# EAGLE schematic Esquematicodrivers (EAGLE 9.6.2)
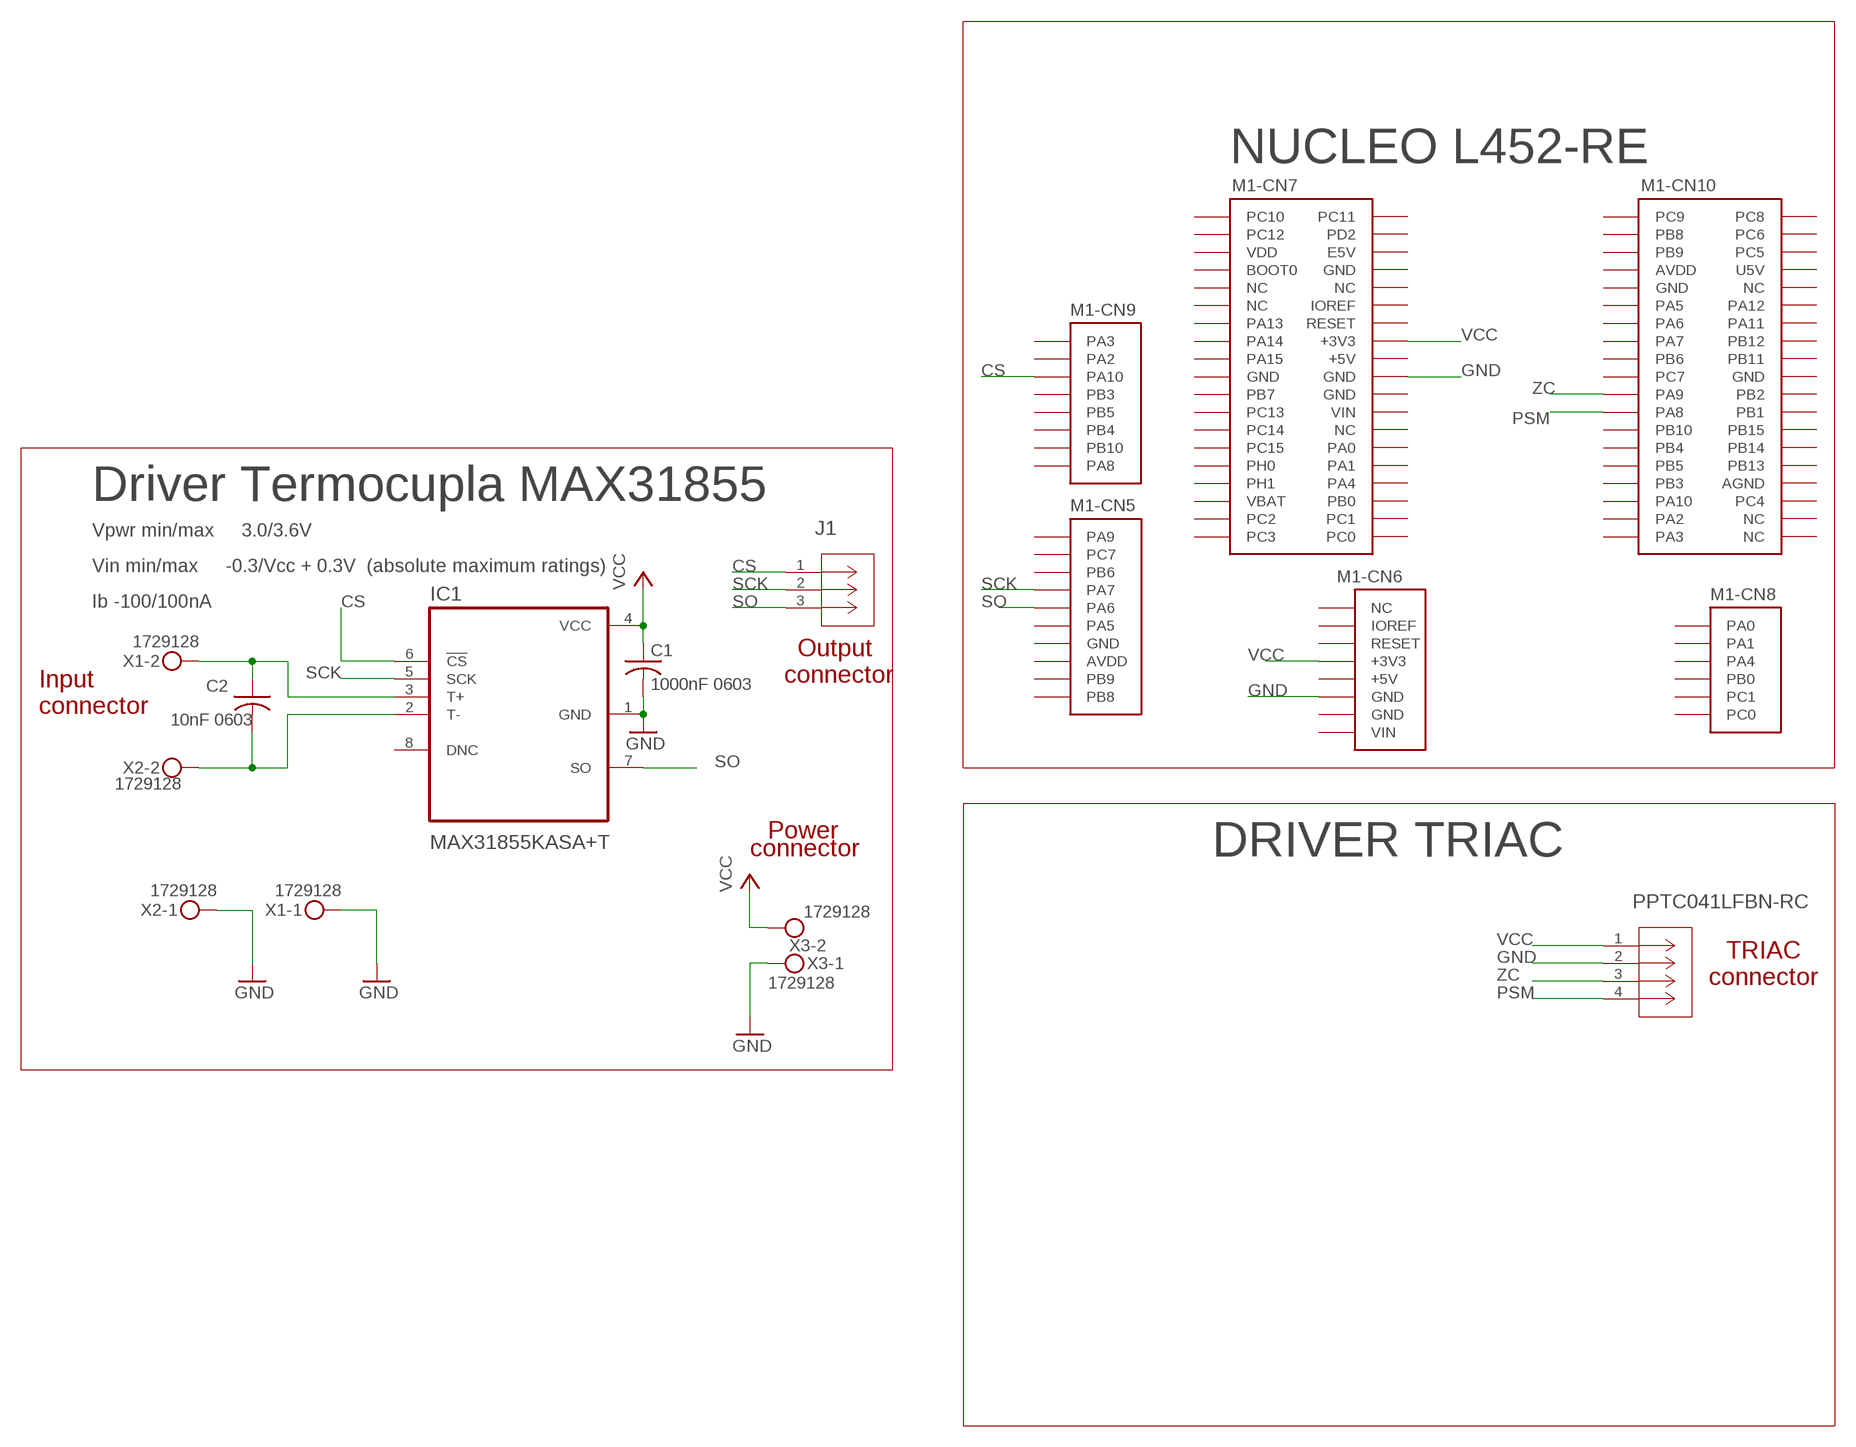
[diagram p0: schematic, sheet 1]

## Parts
C1  1000nF 0603  C-USC0603  [C0603]
C2  10nF 0603  C-USC0603  [C0603]
IC1  MAX31855KASA+T  [SOIC127P600X175-8N]
J1  PPPC031LFBN-RCCONN_PPPC031LFBN-RC_SUL  [CONN_PPPC031LFBN-RC_SUL]
M1  NUCLEO-L452RE  [NUCLEO-64]
PPTC041LFBN-RC  PPTC041LFBN-RCCONN_PPTC041LFBN-RC_SUL  [CONN_PPTC041LFBN-RC_SUL]
X1  1729128  MKDSN1,5/2-5,08  [MKDSN1,5/2-5,08]
X2  1729128  MKDSN1,5/2-5,08  [MKDSN1,5/2-5,08]
X3  1729128  MKDSN1,5/2-5,08  [MKDSN1,5/2-5,08]

## Nets
CS: IC1.6(!CS) J1.1 M1.CN9-3(-CN9:PA10)
GND: C1.2 IC1.1(GND) M1.CN6-6(-CN6:GND) M1.CN7-20(-CN7:GND) PPTC041LFBN-RC.2(GND) X1.1 X2.1 X3.1
N$1: C2.2 IC1.2(T-) X2.2
N$2: C2.1 IC1.3(T+) X1.2
PSM: M1.CN10-23(-CN10:PA8) PPTC041LFBN-RC.4(PWM)
SCK: IC1.5(SCK) J1.2 M1.CN5-4(-CN5:PA7)
SO: IC1.7(SO) J1.3 M1.CN5-5(-CN5:PA6)
VCC: C1.1 IC1.4(VCC) M1.CN6-4(-CN6:+3V3) M1.CN7-16(-CN7:+3V3) PPTC041LFBN-RC.1(VCC) X3.2
ZC: M1.CN10-21(-CN10:PA9) PPTC041LFBN-RC.3(Z-C)
Unconnected: IC1.8(DNC) M1.CN5-1(-CN5:PA9) M1.CN5-2(-CN5:PC7) M1.CN5-3(-CN5:PB6) M1.CN5-6(-CN5:PA5) M1.CN5-9(-CN5:PB9) M1.CN5-10(-CN5:PB8) M1.CN6-1(-CN6:NC) M1.CN6-3(-CN6:RESET) M1.CN7-1(-CN7:PC10) M1.CN7-2(-CN7:PC11) M1.CN7-3(-CN7:PC12) M1.CN7-4(-CN7:PD2) M1.CN7-6(-CN7:E5V) M1.CN7-7(-CN7:BOOT0) M1.CN7-9(-CN7:NC) M1.CN7-10(-CN7:NC) M1.CN7-11(-CN7:NC) M1.CN7-12(-CN7:IOREF) M1.CN7-13(-CN7:PA13) M1.CN7-14(-CN7:RESET) M1.CN7-15(-CN7:PA14) M1.CN7-17(-CN7:PA15) M1.CN7-21(-CN7:PB7) M1.CN7-23(-CN7:PC13) M1.CN7-25(-CN7:PC14) M1.CN7-26(-CN7:NC) M1.CN7-27(-CN7:PC15) M1.CN7-28(-CN7:PA0) M1.CN7-29(-CN7:PH0) M1.CN7-30(-CN7:PA1) M1.CN7-31(-CN7:PH1) M1.CN7-32(-CN7:PA4) M1.CN7-34(-CN7:PB0) M1.CN7-35(-CN7:PC2) M1.CN7-36(-CN7:PC1) M1.CN7-37(-CN7:PC3) M1.CN7-38(-CN7:PC0) M1.CN8-1(-CN8:PA0) M1.CN8-2(-CN8:PA1) M1.CN8-3(-CN8:PA4) M1.CN8-4(-CN8:PB0) M1.CN8-5(-CN8:PC1) M1.CN8-6(-CN8:PC0) M1.CN9-1(-CN9:PA3) M1.CN9-2(-CN9:PA2) M1.CN9-4(-CN9:PB3) M1.CN9-5(-CN9:PB5) M1.CN9-6(-CN9:PB4) M1.CN9-7(-CN9:PB10) M1.CN9-8(-CN9:PA8) M1.CN10-1(-CN10:PC9) M1.CN10-2(-CN10:PC8) M1.CN10-3(-CN10:PB8) M1.CN10-4(-CN10:PC6) M1.CN10-5(-CN10:PB9) M1.CN10-6(-CN10:PC5) M1.CN10-10(-CN10:NC) M1.CN10-11(-CN10:PA5) M1.CN10-12(-CN10:PA12) M1.CN10-13(-CN10:PA6) M1.CN10-14(-CN10:PA11) M1.CN10-15(-CN10:PA7) M1.CN10-16(-CN10:PB12) M1.CN10-17(-CN10:PB6) M1.CN10-18(-CN10:PB11) M1.CN10-19(-CN10:PC7) M1.CN10-22(-CN10:PB2) M1.CN10-24(-CN10:PB1) M1.CN10-25(-CN10:PB10) M1.CN10-26(-CN10:PB15) M1.CN10-27(-CN10:PB4) M1.CN10-28(-CN10:PB14) M1.CN10-29(-CN10:PB5) M1.CN10-30(-CN10:PB13) M1.CN10-31(-CN10:PB3) M1.CN10-33(-CN10:PA10) M1.CN10-34(-CN10:PC4) M1.CN10-35(-CN10:PA2) M1.CN10-36(-CN10:NC) M1.CN10-37(-CN10:PA3) M1.CN10-38(-CN10:NC)

## Notes on the sheet
- NUCLEO L452-RE
- Driver Termocupla MAX31855
- Vpwr min/max     3.0/3.6V
- Vin min/max     -0.3/Vcc + 0.3V  (absolute maximum ratings)
- Ib -100/100nA
- Output 
  connector
- Input
  connector
- Power
- connector | DRIVER TRIAC
- TRIAC
  connector

## Power pins joined to a net without a drawn wire
+5V: M1.CN6-5(-CN6:+5V) M1.CN7-18(-CN7:+5V)
AGND: M1.CN10-32(-CN10:AGND)
AVDD: M1.CN5-8(-CN5:AVDD) M1.CN10-7(-CN10:AVDD)
GND: M1.CN5-7(-CN5:GND) M1.CN6-7(-CN6:GND) M1.CN7-8(-CN7:GND) M1.CN7-19(-CN7:GND) M1.CN7-22(-CN7:GND) M1.CN10-9(-CN10:GND) M1.CN10-20(-CN10:GND)
IOREF: M1.CN6-2(-CN6:IOREF)
U5V: M1.CN10-8(-CN10:U5V)
VBAT: M1.CN7-33(-CN7:VBAT)
VDD: M1.CN7-5(-CN7:VDD)
VIN: M1.CN6-8(-CN6:VIN) M1.CN7-24(-CN7:VIN)

## Library data of the parts
C1 = rcl:C-US: CAPACITOR, American symbol; PARTNO: CC0603KRX7R7BB104; SPICEPREFIX: C
C2 = rcl:C-US: CAPACITOR, American symbol; PARTNO: GRM033R71A103KA01D; SPICEPREFIX: C
IC1 = MAX31855KASA+T-DK:MAX31855KASA+T; PARTNO: MAX31855KASA+T
J1 = PPPC031LFBN-RC:PPPC031LFBN-RC; COPYRIGHT: Copyright (C) 2023 Ultra Librarian. All rights reserved.; MANUFACTURER_PART_NUMBER: PPPC031LFBN-RC; MFR_NAME: Sullins; PARTNO: PPPC031LFBN-RC
M1 = NUCLEO-L452RE:NUCLEO-L452RE: No existe un outline (Layer Dimension) para esta librería. En su lugar se utilizó una referencia en tDocu. Al momento de diseñar la tarjeta, el Dimension debe ser dibujado según los requerimientos del usuario, o simplemente copiar los contenidos del tDocu en Dimensions.
PPTC041LFBN-RC = PPTC041LFBN-RC:PPTC041LFBN-RC; COPYRIGHT: Copyright (C) 2023 Ultra Librarian. All rights reserved.; MANUFACTURER_PART_NUMBER: PPTC041LFBN-RC; MFR_NAME: Sullins; PARTNO: PPTC041LFBN-RC
X1-X3 = 1729128-PHOENIX CONTACT:MKDSN1,5/2-5,08: MKDSN 1,5/ 2-5,08 Printklemme Nennstrom: 13,5 A Nennspannung: 250 V Rastermaß: 5,08 mm Polzahl: 2 Anschlussart: Schraubanschluss Montage: Löten Anschlussrichtung Leiter/Platine: 0 ° Artikelnummer: 1729128 Source: http://eshop.phoenixcontact.com .. 1729128.pdf; PARTNO: 1729128